# Altium schematic sheet POWER.SchDoc
size A4
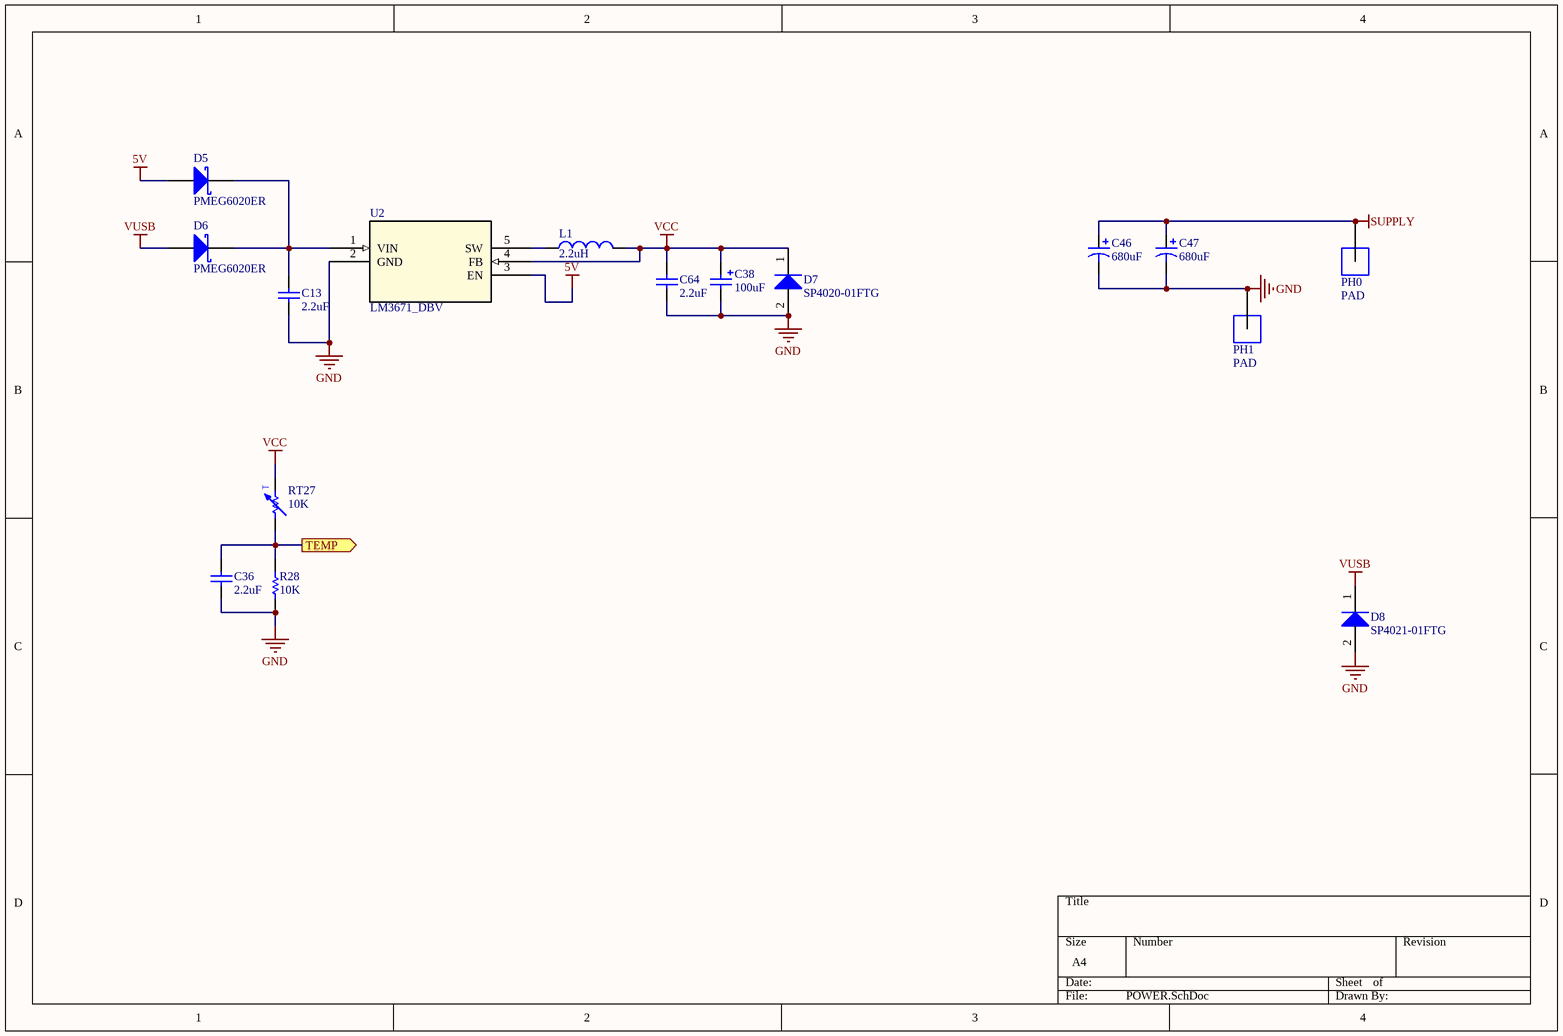
[diagram p0: POWER.SchDoc]

## Parts
C13  value 2.2uF  [C1206[3216X160]]  (hidden comment: 2.2uF 6.3V 1206)
C36  value 2.2uF  [C0603[1608X92]]  (hidden comment: 2.2uF 6.3V 0603)
C38  value 100uF  [C1206[3216X105]_Tantal]  (hidden comment: 100uF 16V 1206)
C46  value 680uF  [CAP_ELEC_THRU_5MM_HORZ]  (hidden comment: 680uF 63V)
C47  value 680uF  [CAP_ELEC_THRU_5MM_HORZ]  (hidden comment: 680uF 63V)
C64  value 2.2uF  [C1206[3216X160]]  (hidden comment: 2.2uF 6.3V 1206)
D5  PMEG6020ER  [SOD-123]
D6  PMEG6020ER  [SOD-123]
D7  SP4020-01FTG  [SOD-323]
D8  SP4021-01FTG  [SOD-323]
L1  2.2uH  [IND0805]
PH0  PAD  [PAD]
PH1  PAD  [PAD]
R28  value 10K  [R0603[1608]]  (hidden comment: 10K 1% 0603)
RT27  value 10K  [R0603[1608]]  (hidden comment: 10K 0.5% 0603)
U2  LM3671_DBV  [SOT23/MF05A]

## Ports
TEMP (out)

## Nets
5V: D5.2(A) U2.3(EN)
GND: C13.2 C36.1 C38.2 C46.2 C47.2 C64.2 D7.2(A) D8.2(A) PH1.0(PH) R28.1 U2.2(GND)
SUPPLY: C46.1 C47.1 PH0.0(PH)
VCC: C38.1 C64.1 D7.1(K) L1.2 RT27.2 U2.4(FB)
VUSB: D6.2(A) D8.1(K)
TEMP: C36.2 R28.2 RT27.1 ; port TEMP
NetC13_1: C13.1 D5.1(K) D6.1(K) U2.1(VIN)
NetL1_1: L1.1 U2.5(SW)

## Notes on the sheet
- (in symbol NTC_10K_0603_0.5%) T

## Library data of the parts
C13 C64 = CAP_2.2uF_16V_1206_10%: 2.2uF 6.3V 10% 1206 (3216 Metric); PartNumber: GRM31CR60J476KE19L; Manufacturer: Murata; Voltage: 16V; Mounting Technology: Surface Mount; PackageReference: 1206; PackageDescription: 1206 (3216 Metric); Tolerance: 10%
C36 = CAP_2.2uF_6.3V_0603_10%: 2.2uF 6.3V 10% 0603 (1608 Metric); PartNumber: GRM185R60J225KE26D; Manufacturer: Murata; TemperatureCoefficient: X5R; Mounting Technology: Surface Mount; PackageReference: 0603; PackageDescription: 0603 (1608 Metric); Voltage: 6.3V; Tolerance: 10%
C38 = CAP_100uF_16V_1206_20%: TANTAL 100uF 16V 20% 1206 (3216 Metric); PartNumber: F931C107MCCAJ6; Manufacturer: AVX Corporation; Mounting Technology: Surface Mount; PackageReference: 1206; PackageDescription: 1206 (3216 Metric); Voltage: 16V; Tolerance: 20%
C46 C47 = CAP_680uF_63V_20%: 680uF 63V 20%  EC; PartNumber: EKZN630ELL681MK30S; Manufacturer: United Chemi-Con; Mounting Technology: Through Hall; PackageReference: 1H; PackageDescription: 12.5x31.5mm; Voltage: 63V; Tolerance: 20%
D5 D6 = PMEG6020ER: PartNumber: PMEG6020ER,115; Manufacturer: NXP Semiconductors; PackageReference: SOD-123W; PackageDescription: SOD, 2-Leads, Body 2.69x1.6mm; Mounting Technology: Surface Mount
D7 = SP4020-01FTG: Manufacturer: Littelfuse; PartNumber: SP4020-01FTG; PackageReference: SOD-323-2; Mounting Technology: Surface Mount
D8 = SP4021-01FTG: Manufacturer: Littelfuse; PartNumber: SP4021-01FTG; PackageReference: SOD-323-2; Mounting Technology: Surface Mount
L1 = IND_2.2uH_1.7A_0805_20%: 2.2uH 20% 1.7A 0805; PartNumber: LQM21PN2R2MGHL; Manufacturer: Murata; PackageReference: 0805; PackageDescription: 0805 (2012 metric); Mounting Technology: Surface Mount; Current: 1.7A; Value: 2.2uH
R28 = RES_10K_0603_1%: 10K 0.25W 1% 0603 (1005 Metric); Manufacturer: Vishay; PartNumber: RCS060310K0FKEA; Tolerance: 1%; Power: 0.25W; Mounting Technology: Surface Mount; PackageReference: 0603; PackageDescription: 0603 (1608 Metric); ComponentLink1Description: Datasheet; ComponentLink1URL: http://www.vishay.com/docs/20065/rcse3.pdf
RT27 = NTC_10K_0603_0.5%: NTC 10K 0.5% 0603 (1608 Metric); PartNumber: NCP18XH103D60RC; Manufacturer: Murata; Power: 0.1W; Mounting Technology: Surface Mount; PackageReference: 0603; PackageDescription: 0603 (1608 Metric); Tolerance: 0.5%
U2 = LM3671_DBV: 600-mA Step-Down DC-DC Converter; Manufacturer: Texas Instruments; basePN: LM3671; DatasheetURL: http://www.ti.com/lit/ds/symlink/lm3671.pdf; Vendor: Texas Instruments; Value: Value; Type: Type; RefDes: RefDes; PackageReference: MF05A; PartNumber: LM3671_DBV